# Altium schematic sheet ESP32_Module.SchDoc: ESP32-WROOM32D Module
size A4; DocumentNumber: 15; SheetNumber: 15; SheetTotal: 51
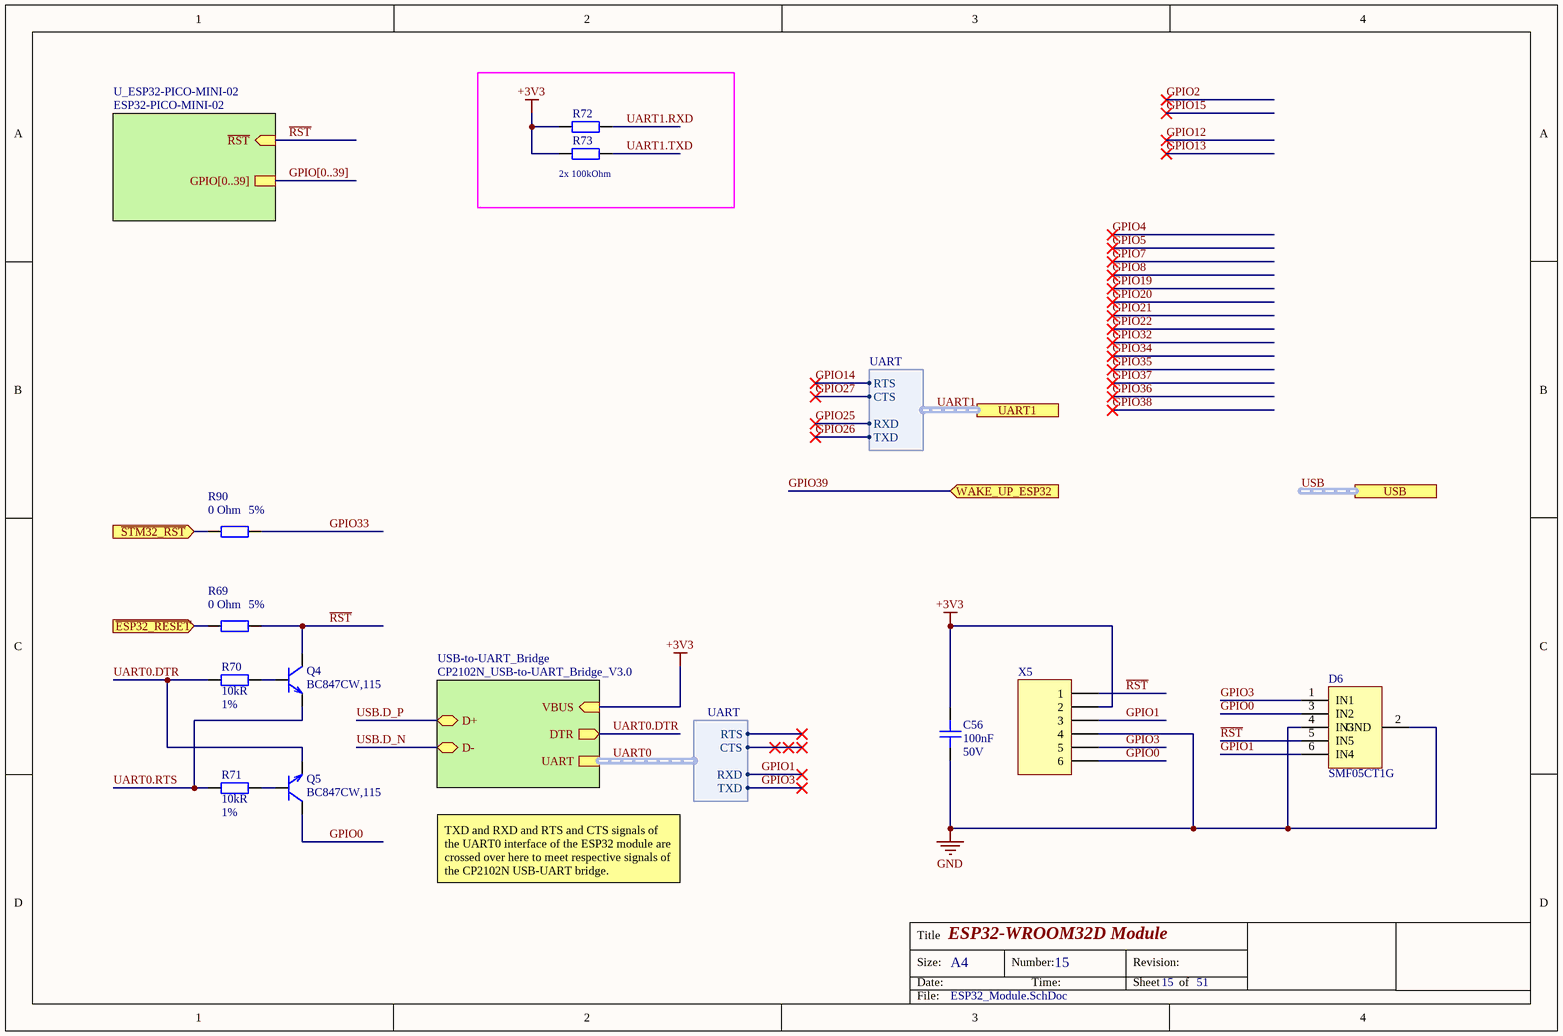
[diagram p0: ESP32_Module.SchDoc]

## Parts
C56  Capacitance: 100nF  Voltage: 50V  [C0402]  (hidden comment: CAP CER 0.1UF 50V X7R 0402)
D6  SMF05CT1G  [SOT363_SOP65P210X265-6N]
Q4  BC847CW,115  [SOT-323]
Q5  BC847CW,115  [SOT-323]
R69  Tolerance: 5%  Resistance: 0 Ohm  [R0402]  (hidden comment: RES SMD 0 OHM JUMPER 1/16W 0402)
R70  Resistance: 10kR  Tolerance: 1%  [R0402]  (hidden comment: RES SMD 10K OHM 1% 1/16W 0402)
R71  Resistance: 10kR  Tolerance: 1%  [R0402]  (hidden comment: RES SMD 10K OHM 1% 1/16W 0402)
R72  RES SMD 100K OHM 1% 1/16W 0402  [R0402]  (value not drawn)
R73  RES SMD 100K OHM 1% 1/16W 0402  [R0402]  (value not drawn)
R90  Tolerance: 5%  Resistance: 0 Ohm  [R0402]  (hidden comment: RES SMD 0 OHM JUMPER 1/16W 0402)
X5  (no value)  [TC2030-IDC-NL]  (no BOM)

## Blocks framed on the sheet
2x 100kOhm: R72 R73

## Sub-sheets
U_ESP32-PICO-MINI-02 = ESP32-PICO-MINI-02: ~{RST} (in), GPIO[0..39]
USB-to-UART_Bridge = CP2102N_USB-to-UART_Bridge_V3.0: VBUS (in), D+ (bidir), D- (bidir), UART (harness UART), DTR (out)

## Ports
UART1 (harness UART), USB (harness USB), WAKE_UP_ESP32 (in), ~{ESP32_RESET} (in), ~{STM32_RST} (in)

## Harnesses
UART: RTS, CTS, RXD, TXD

## Nets
+3V3: C56.2 R72.1 R73.1 X5.2 ; sheet USB-to-UART_Bridge/VBUS
GND: C56.1 D6.2(GND) D6.4(IN3) X5.4
~{ESP32_RESET}: R69.1 ; port ~{ESP32_RESET}
~{RST}: D6.5(IN5) Q4.3(C) R69.2 X5.1 ; sheet U_ESP32-PICO-MINI-02/~{RST}
~{STM32_RST}: R90.1 ; port ~{STM32_RST}
GPIO0: D6.3(IN2) Q5.3(C) X5.6
GPIO1: D6.6(IN4) X5.3 ; sheet USB-to-UART_Bridge/UART.RXD
GPIO3: D6.1(IN1) X5.5 ; sheet USB-to-UART_Bridge/UART.TXD
GPIO14: port UART1.RTS
GPIO25: port UART1.RXD
GPIO26: port UART1.TXD
GPIO27: port UART1.CTS
GPIO33: R90.2
GPIO39: port WAKE_UP_ESP32
UART0.DTR: Q5.2(E) R70.1 ; sheet USB-to-UART_Bridge/DTR
UART0.RTS: Q4.2(E) R71.1
UART1.RXD: R72.2
UART1.TXD: R73.2
USB.D_N: sheet USB-to-UART_Bridge/D-
USB.D_P: sheet USB-to-UART_Bridge/D+
NetQ4_1: Q4.1(B) R70.2
NetQ5_1: Q5.1(B) R71.2

## Buses and harness runs
bus GPIO[0..39] = sheet U_ESP32-PICO-MINI-02/GPIO[0..39]
harness UART0 = sheet USB-to-UART_Bridge/UART
harness UART1 = port UART1
harness USB = port USB

## Notes on the sheet
- TXD and RXD and RTS and CTS signals of the UART0 interface of the ESP32 module are crossed over here to meet respective signals of the CP2102N USB-UART bridge.
- Title
- Size:
- Date:
- A4
- Number:
- Time:
- Revision:
- Sheet
- of
- File:

## Library data of the parts
C56 = CAP CER 0.1UF 50V X7R 0402: 0.1µF ±10% 50V Ceramic Capacitor X7R 0402 (1005 Metric); Manufacturer: TDK; Manufacturer Part Number: CGA2B3X7R1H104K050BB; Supplier 1: Digi-Key; Stock 1: 2925303; Pricing 1: 1=0.17, 10=0.118, 50=0.0668, 100=0.0553, 500=0.0388, 1000=0.0321, 2500=0.0299, 5000=0.0273 (USD); Mount: Surface Mount; Case/Package: 0402; Weight: 2.3E-05oz; Case Code (Metric): 1005; Case Code (Imperial): 0402; Min Operating Temperature: -55°C; Max Operating Temperature: 125°C; Voltage Rating: 50V; Tolerance: 10%; Packaging: Tape and Reel; Package Quantity: 1; Voltage Rating (DC): 50V; Dielectric: X7R; Termination: SMD/SMT; Composition: Ceramic; Length: 1mm; Height: 0.5mm; Width: 0.02inch; Thickness: 0.022inch; Depth: 0.5mm; Ratings: AEC-Q200; REACH SVHC: No SVHC; Lead Free: Lead Free; ComponentLink1URL: http://product.tdk.com/capacitor/mlcc/en/documents/mlccspec_automotive_general_midvoltage_en.pdf?src-supplier=Future+Electronics; ComponentLink1Description: http://product.tdk.com/capacitor/mlcc/en/documents/mlccspec_automotive_general_midvoltage_en.pdf?src-supplier=Future+Electronics; ComponentLink2URL: http://www.farnell.com/datasheets/1807242.pdf?src-supplier=Element14; ComponentLink2Description: http://www.farnell.com/datasheets/1807242.pdf?src-supplier=Element14; ComponentLink3URL: http://www.mouser.com/ds/2/400/lcc_automotive_general_en-843974.pdf?src-supplier=Mouser; ComponentLink3Description: http://www.mouser.com/ds/2/400/lcc_automotive_general_en-843974.pdf?src-supplier=Mouser; ComponentLink4URL: http://www.farnell.com/datasheets/1936565.pdf?src-supplier=Element14; ComponentLink4Description: http://www.farnell.com/datasheets/1936565.pdf?src-supplier=Element14; ComponentLink5URL: http://www.farnell.com/datasheets/1735392.pdf?src-supplier=Element14; ComponentLink5Description: http://www.farnell.com/datasheets/1735392.pdf?src-supplier=Element14; Supplier Part Number 1: 445-6899-1-ND
D6 = TVS DIODE 5V 12.5V 5CH SC88: 12.5V Clamp 8A (8/20µs) Ipp Tvs Diode Surface Mount SC-88/SC70-6/SOT-363; Manufacturer: ON Semiconductor; Capacitance: 130pF; Direction: Unidirectional; Reverse Breakdown Voltage: 6.2V; Number of Elements: 5; Reverse Standoff Voltage: 5V; Peak Pulse Power: 100W; Power Line Protection: No; Leakage Current: 5uA; Test Current: 1mA; ESD Protection: Yes; Max Breakdown Voltage: 7.2V; Element Configuration: Common Anode; Supplier 1: Digi-Key; Manufacturer Part Number: SMF05CT1G; Stock 1: 33811; Pricing 1: 1=0.41, 10=0.307, 25=0.2768, 100=0.1459, 250=0.1444, 500=0.1293, 1000=0.1006 (USD); Case/Package: SC; Number of Pins: 6; Min Operating Temperature: -40°C; Max Operating Temperature: 125°C; Packaging: Tape and Reel; Number of Channels: 5; Min Breakdown Voltage: 6.2V; Clamping Voltage: 12.5V; Peak Pulse Current: 8A; Polarity: Unidirectional; Working Voltage: 5V; Max Reverse Leakage Current: 5uA; Max Power Dissipation: 100W; Breakdown Voltage: 6.2V; Voltage Rating (DC): 5V; Length: 2mm; Height: 1mm; Width: 1.25mm; Depth: 1.25mm; Radiation Hardening: No; REACH SVHC: No SVHC; Lead Free: Lead Free; ComponentLink1URL: http://www.farnell.com/datasheets/1708354.pdf?src-supplier=Element14; ComponentLink1Description: http://www.farnell.com/datasheets/1708354.pdf?src-supplier=Element14; ComponentLink2URL: http://www.onsemi.com/pub/Collateral/SMF05C-D.PDF?src-supplier=Digi-Key; ComponentLink2Description: http://www.onsemi.com/pub/Collateral/SMF05C-D.PDF?src-supplier=Digi-Key; ComponentLink3URL: http://www.mouser.com/ds/2/308/SMF05C-D-100912.pdf?src-supplier=Mouser; ComponentLink3Description: http://www.mouser.com/ds/2/308/SMF05C-D-100912.pdf?src-supplier=Mouser; ComponentLink4URL: http://www.onsemi.com/pub/Collateral/SMF05C-D.PDF?src-supplier=Avnet; ComponentLink4Description: http://www.onsemi.com/pub/Collateral/SMF05C-D.PDF?src-supplier=Avnet; ComponentLink5URL: https://www.verical.com/server-webapp/html/getDatasheet?partID=98371&src-supplier=Verical; ComponentLink5Description: https://www.verical.com/server-webapp/html/getDatasheet?partID=98371&src-supplier=Verical; Supplier Part Number 1: SMF05CT1GOSCT-ND; Contact Plating: Tin,Matte; Package Quantity: 1; Max Surge Current: 8A; Number of Unidirectional Channels: 5; Termination: SMD/SMT; Power Dissipation: 100W; Max Output Current: 8A; Composition: Zener; Mount: Surface Mount
Q4 Q5 = TRANS BC847CW,115 NPN 45V 0.1A SOT323: Bipolar (BJT) Transistor NPN 45V 100mA 100MHz 200mW Surface Mount SOT-323-3; Manufacturer: Nexperia; Supplier 1: Digi-Key; Manufacturer Part Number: BC847CW,115; Stock 1: 327256; Pricing 1: 1=0.13, 10=0.118, 25=0.1124, 100=0.0495, 250=0.0475, 500=0.0389, 1000=0.027 (USD); ComponentLink1URL: http://www.farnell.com/datasheets/1856333.pdf?src-supplier=Farnell; ComponentLink1Description: http://www.farnell.com/datasheets/1856333.pdf?src-supplier=Farnell; ComponentLink2URL: http://www.farnell.com/datasheets/1856333.pdf?src-supplier=Element14; ComponentLink2Description: http://www.farnell.com/datasheets/1856333.pdf?src-supplier=Element14; ComponentLink3URL: https://assets.nexperia.com/documents/data-sheet/BC847_SER.pdf?src-supplier=Digi-Key; ComponentLink3Description: https://assets.nexperia.com/documents/data-sheet/BC847_SER.pdf?src-supplier=Digi-Key; ComponentLink4URL: http://www.farnell.com/datasheets/1856333.pdf?src-supplier=Newark; ComponentLink4Description: http://www.farnell.com/datasheets/1856333.pdf?src-supplier=Newark; Supplier Part Number 1: 1727-4312-1-ND; ClassName: U_ESP32-WROOM32D_Module; Mount: Surface Mount
R69 R90 = RES SMD 0 OHM JUMPER 1/16W 0402: 0 Ohms Jumper 0.063W, 1/16W Chip Resistor 0402 (1005 Metric) Moisture Resistant Thick Film; Manufacturer: Yageo; Manufacturer Part Number: RC0402JR-070RL; Power Rating: 62.5mW; Voltage Rating: 50V; Max Power Dissipation: 63mW; Temperature Coefficient: 200ppm/°C; Supplier 1: Digi-Key; Stock 1: 46057148; Pricing 1: 1=0.1, 10=0.013, 25=0.0092, 50=0.0072, 100=0.0053, 250=0.004, 500=0.0032, 1000=0.0024, 5000=0.0017 (USD); Contact Plating: Tin,Matte; Case Code (Metric): 1005; Case Code (Imperial): 0402; Min Operating Temperature: -55°C; Max Operating Temperature: 155°C; Packaging: Tape and Reel; Composition: Thick Film; Package Quantity: 1; Number of Terminations: 2; Termination: SMD/SMT; Military Standard: Not; Features: Moisture Resistant; Length: 1mm; Height: 0.016inch; Width: 0.02inch; Depth: 0.5mm; Radiation Hardening: No; REACH SVHC: Unknown; Lead Free: Lead Free; ComponentLink1URL: http://www.yageo.com/documents/recent/PYu-RC_Group_51_RoHS_L_10.pdf?src-supplier=Digi-Key; ComponentLink1Description: http://www.yageo.com/documents/recent/PYu-RC_Group_51_RoHS_L_10.pdf?src-supplier=Digi-Key; ComponentLink2URL: http://www.yageo.com/documents/recent/PYu-RC0402_51_RoHS_L_6.pdf?src-supplier=Avnet+Europe; ComponentLink2Description: http://www.yageo.com/documents/recent/PYu-RC0402_51_RoHS_L_6.pdf?src-supplier=Avnet+Europe; ComponentLink3URL: http://www.farnell.com/datasheets/1018594.pdf?src-supplier=Element14; ComponentLink3Description: http://www.farnell.com/datasheets/1018594.pdf?src-supplier=Element14; ComponentLink4URL: https://www.verical.com/server-webapp/html/getDatasheet?partID=326379&src-supplier=Verical; ComponentLink4Description: https://www.verical.com/server-webapp/html/getDatasheet?partID=326379&src-supplier=Verical; ComponentLink5URL: http://www.farnell.com/datasheets/2167052.pdf?src-supplier=Element14; ComponentLink5Description: http://www.farnell.com/datasheets/2167052.pdf?src-supplier=Element14; Supplier Part Number 1: 311-0.0JRCT-ND; Case/Package: 0402; ClassName: U_ESP32-WROOM32D_Module; Mount: Surface Mount
R70 R71 = RES SMD 10K OHM 1% 1/16W 0402: 10 kOhms ±1% 0.063W, 1/16W Chip Resistor 0402 (1005 Metric) Moisture Resistant Thick Film; Manufacturer Part Number: RC0402FR-0710KP; Manufacturer: Yageo; Temperature Coefficient: 150ppm/°C; Max Power Dissipation: 63mW; Supplier 1: Digi-Key; Stock 1: 839368; Pricing 1: 1=0.1, 10=0.035, 100=0.014, 1000=0.0063, 2500=0.0055, 5000=0.0045 (USD); Case Code (Imperial): 0402; Case Code (Metric): 1005; Min Operating Temperature: -55°C; Max Operating Temperature: 155°C; Composition: Thick Film; Packaging: Tape and Reel; Number of Terminations: 2; Length: 0.039inch; Height: 0.016inch; Width: 0.02inch; ComponentLink1URL: http://www.yageo.com/NewPortal/yageodocoutput?fileName=/pdf/R-Chip/PYu-RC_51_RoHS_P_0.pdf&src-supplier=Digi-Key; ComponentLink1Description: http://www.yageo.com/NewPortal/yageodocoutput?fileName=/pdf/R-Chip/PYu-RC_51_RoHS_P_0.pdf&src-supplier=Digi-Key; Supplier Part Number 1: YAG1249CT-ND; Case/Package: 0402; Features: Moisture Resistant; ClassName: U_ESP32-WROOM32D_Module; Mount: Surface Mount
R72 R73 = RES SMD 100K OHM 1% 1/16W 0402: 100 kOhms ±1% 0.063W, 1/16W Chip Resistor 0402 (1005 Metric) Moisture Resistant Thick Film; Manufacturer: Yageo; Manufacturer Part Number: RC0402FR-07100KL; Temperature Coefficient: 100ppm/°C; Power Rating: 63mW; Voltage Rating: 50V; Supplier 1: Digi-Key; Stock 1: 47448883; Pricing 1: 1=0.1, 10=0.016, 100=0.0064, 1000=0.0029, 2500=0.0025, 5000=0.0021 (USD); Case Code (Metric): 1005; Case Code (Imperial): 0402; Min Operating Temperature: -55°C; Max Operating Temperature: 155°C; Composition: Thick Film; Packaging: Tape and Reel; Package Quantity: 1; Number of Terminations: 2; Termination: SMD/SMT; Military Standard: Not; Max Power Dissipation: 63mW; Working Voltage: 50V; Features: Moisture Resistant; Length: 0.039inch; Height: 0.016inch; Width: 0.02inch; Depth: 0.5mm; REACH SVHC: No SVHC; Lead Free: Lead Free; ComponentLink1URL: http://www.yageo.com/documents/recent/PYu-RC_Group_51_RoHS_L_10.pdf?src-supplier=Digi-Key; ComponentLink1Description: http://www.yageo.com/documents/recent/PYu-RC_Group_51_RoHS_L_10.pdf?src-supplier=Digi-Key; ComponentLink2URL: http://www.farnell.com/datasheets/1018594.pdf?src-supplier=Element14; ComponentLink2Description: http://www.farnell.com/datasheets/1018594.pdf?src-supplier=Element14; ComponentLink3URL: http://www.yageo.com/documents/recent/PYu-RC_Group_51_RoHS_L_9.pdf?src-supplier=Verical; ComponentLink3Description: http://www.yageo.com/documents/recent/PYu-RC_Group_51_RoHS_L_9.pdf?src-supplier=Verical; ComponentLink4URL: http://www.yageo.com/documents/recent/PYu-RC_Group_51_RoHS_L_9.pdf?src-supplier=Mouser; ComponentLink4Description: http://www.yageo.com/documents/recent/PYu-RC_Group_51_RoHS_L_9.pdf?src-supplier=Mouser; ComponentLink5URL: http://documents.rs-components.com/techlib://itc_doclist_GB.htm?stockno=6185797&src-supplier=RSComponents; ComponentLink5Description: http://documents.rs-components.com/techlib://itc_doclist_GB.htm?stockno=6185797&src-supplier=RSComponents; Supplier Part Number 1: 311-100KLRDKR-ND; Case/Package: 0402; Tolerance: 1%; Resistance: 100 kOhm; Mount: Surface Mount
X5 = TC2030-IDC-NL: Tag-Connect TC2030-MCP-NL (3x2 pins No Legs); Manufacturer: Tag-Connect LLC; Manufacturer Part Number: TC2030-IDC-NL